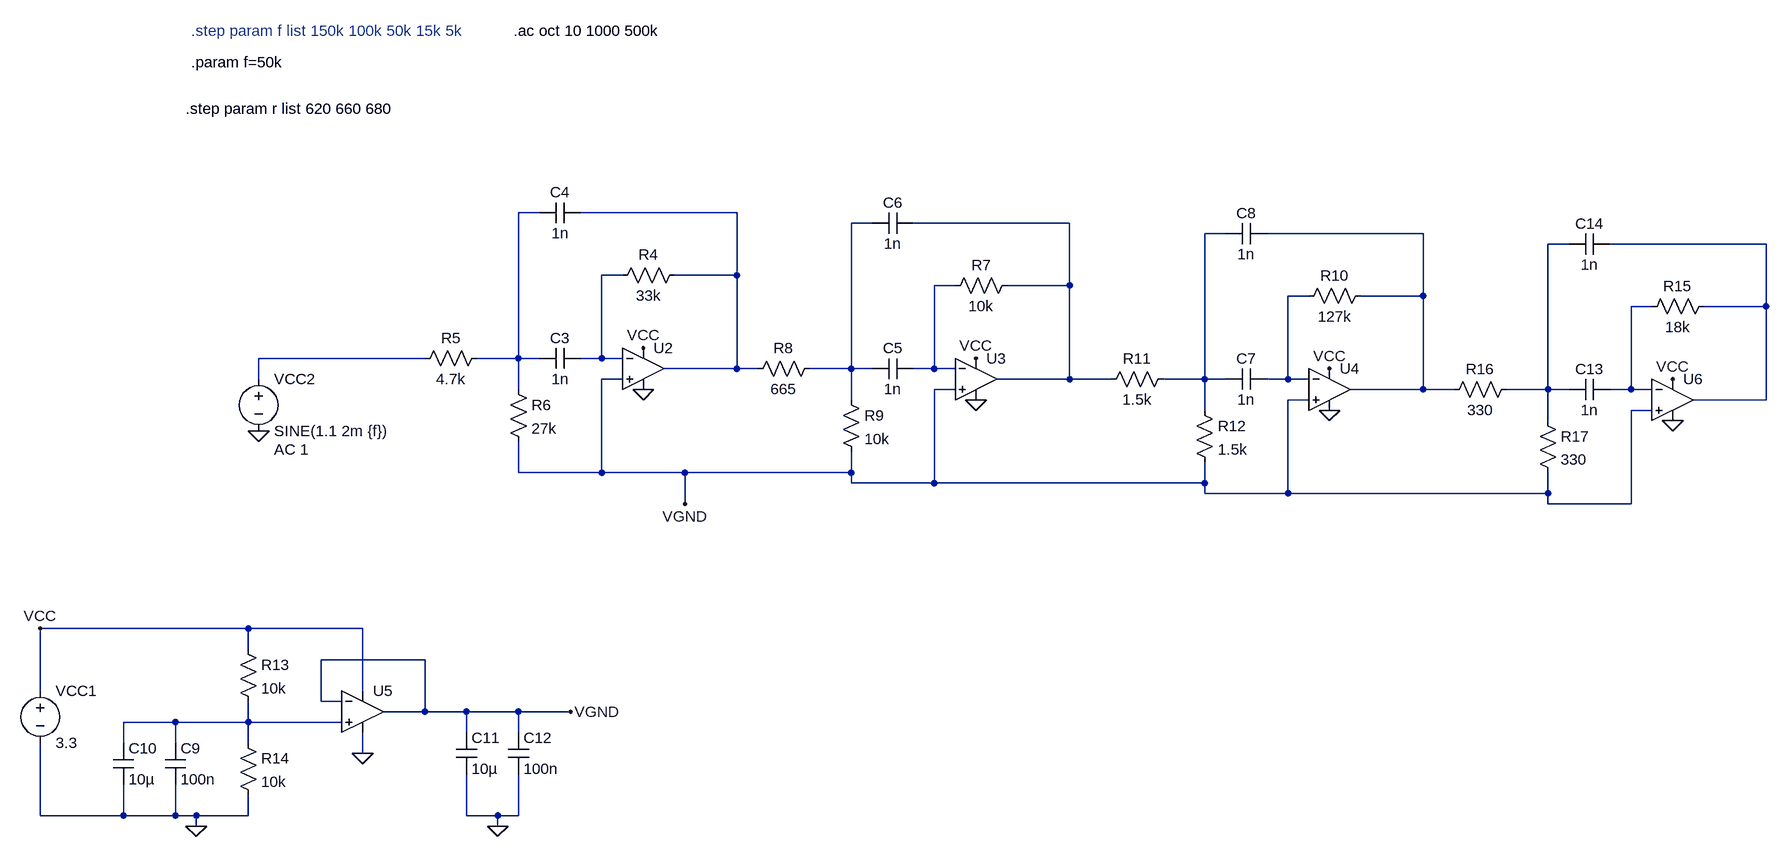
[diagram p0: schematic AudioFilter.asc]
AudioFilter.asc, the LTspice schematic file:
Version 4
SHEET 1 2344 852
WIRE 448 -112 416 -112
WIRE 752 -112 512 -112
WIRE 960 -96 928 -96
WIRE 1264 -96 1024 -96
WIRE 1504 -80 1472 -80
WIRE 1808 -80 1568 -80
WIRE 2032 -64 2000 -64
WIRE 2336 -64 2096 -64
WIRE 576 -16 544 -16
WIRE 752 -16 752 -112
WIRE 752 -16 656 -16
WIRE 1088 0 1056 0
WIRE 1264 0 1264 -96
WIRE 1264 0 1168 0
WIRE 1632 16 1600 16
WIRE 1808 16 1808 -80
WIRE 1808 16 1712 16
WIRE 2160 32 2128 32
WIRE 2336 32 2336 -64
WIRE 2336 32 2240 32
WIRE 272 112 16 112
WIRE 416 112 416 -112
WIRE 416 112 352 112
WIRE 448 112 416 112
WIRE 544 112 544 -16
WIRE 544 112 512 112
WIRE 576 112 544 112
WIRE 752 128 752 -16
WIRE 752 128 640 128
WIRE 784 128 752 128
WIRE 928 128 928 -96
WIRE 928 128 864 128
WIRE 960 128 928 128
WIRE 1056 128 1056 0
WIRE 1056 128 1024 128
WIRE 1088 128 1056 128
WIRE 16 144 16 112
WIRE 576 144 544 144
WIRE 1264 144 1264 0
WIRE 1264 144 1152 144
WIRE 1328 144 1264 144
WIRE 1472 144 1472 -80
WIRE 1472 144 1408 144
WIRE 1504 144 1472 144
WIRE 1600 144 1600 16
WIRE 1600 144 1568 144
WIRE 1632 144 1600 144
WIRE 416 160 416 112
WIRE 1088 160 1056 160
WIRE 1808 160 1808 16
WIRE 1808 160 1696 160
WIRE 1856 160 1808 160
WIRE 2000 160 2000 -64
WIRE 2000 160 1936 160
WIRE 2032 160 2000 160
WIRE 2128 160 2128 32
WIRE 2128 160 2096 160
WIRE 2160 160 2128 160
WIRE 928 176 928 128
WIRE 1632 176 1600 176
WIRE 2336 176 2336 32
WIRE 2336 176 2224 176
WIRE 1472 192 1472 144
WIRE 2160 192 2128 192
WIRE 2000 208 2000 160
WIRE 416 288 416 240
WIRE 544 288 544 144
WIRE 544 288 416 288
WIRE 672 288 544 288
WIRE 928 288 928 256
WIRE 928 288 672 288
WIRE 928 304 928 288
WIRE 1056 304 1056 160
WIRE 1056 304 928 304
WIRE 1472 304 1472 272
WIRE 1472 304 1056 304
WIRE 1472 320 1472 304
WIRE 1600 320 1600 176
WIRE 1600 320 1472 320
WIRE 2000 320 2000 288
WIRE 2000 320 1600 320
WIRE 672 336 672 288
WIRE 2000 336 2000 320
WIRE 2128 336 2128 192
WIRE 2128 336 2000 336
WIRE 0 528 -320 528
WIRE 176 528 0 528
WIRE 0 560 0 528
WIRE 272 576 112 576
WIRE -320 624 -320 528
WIRE 176 624 176 528
WIRE 112 640 112 576
WIRE 144 640 112 640
WIRE 272 656 272 576
WIRE 272 656 208 656
WIRE 336 656 272 656
WIRE 416 656 336 656
WIRE 496 656 416 656
WIRE -112 672 -192 672
WIRE 0 672 0 640
WIRE 0 672 -112 672
WIRE 144 672 0 672
WIRE 336 688 336 656
WIRE 416 688 416 656
WIRE -192 704 -192 672
WIRE -112 704 -112 672
WIRE 0 704 0 672
WIRE 176 720 176 688
WIRE -320 816 -320 704
WIRE -192 816 -192 768
WIRE -192 816 -320 816
WIRE -112 816 -112 768
WIRE -112 816 -192 816
WIRE -80 816 -112 816
WIRE 0 816 0 784
WIRE 0 816 -80 816
WIRE 336 816 336 752
WIRE 384 816 336 816
WIRE 416 816 416 752
WIRE 416 816 384 816
WIRE -80 832 -80 816
WIRE 384 832 384 816
FLAG 608 160 0
FLAG 608 96 VCC
FLAG 1120 176 0
FLAG 1120 112 VCC
FLAG 1664 192 0
FLAG 1664 128 VCC
FLAG -80 832 0
FLAG 496 656 VGND
FLAG 384 832 0
FLAG 176 720 0
FLAG -320 528 VCC
FLAG 672 336 VGND
FLAG 16 224 0
FLAG 2192 208 0
FLAG 2192 144 VCC
SYMBOL Opamps\\UniversalOpamp2 608 128 R0
SYMATTR InstName U2
SYMATTR Value2 Avol=1Meg GBW=15Meg Slew=10Meg
SYMBOL res 560 0 R270
WINDOW 0 32 56 VTop 2
WINDOW 3 0 56 VBottom 2
SYMATTR InstName R4
SYMATTR Value 33k
SYMBOL res 256 128 R270
WINDOW 0 32 56 VTop 2
WINDOW 3 0 56 VBottom 2
SYMATTR InstName R5
SYMATTR Value 4.7k
SYMBOL res 400 144 R0
SYMATTR InstName R6
SYMATTR Value 27k
SYMBOL cap 512 96 R90
WINDOW 0 0 32 VBottom 2
WINDOW 3 32 32 VTop 2
SYMATTR InstName C3
SYMATTR Value 1n
SYMBOL cap 512 -128 R90
WINDOW 0 0 32 VBottom 2
WINDOW 3 32 32 VTop 2
SYMATTR InstName C4
SYMATTR Value 1n
SYMBOL Opamps\\UniversalOpamp2 1120 144 R0
SYMATTR InstName U3
SYMATTR Value2 Avol=1Meg GBW=15Meg Slew=10Meg
SYMBOL res 1072 16 R270
WINDOW 0 32 56 VTop 2
WINDOW 3 0 56 VBottom 2
SYMATTR InstName R7
SYMATTR Value 10k
SYMBOL res 768 144 R270
WINDOW 0 32 56 VTop 2
WINDOW 3 0 56 VBottom 2
SYMATTR InstName R8
SYMATTR Value 665
SYMBOL res 912 160 R0
SYMATTR InstName R9
SYMATTR Value 10k
SYMBOL cap 1024 112 R90
WINDOW 0 0 32 VBottom 2
WINDOW 3 32 32 VTop 2
SYMATTR InstName C5
SYMATTR Value 1n
SYMBOL cap 1024 -112 R90
WINDOW 0 0 32 VBottom 2
WINDOW 3 32 32 VTop 2
SYMATTR InstName C6
SYMATTR Value 1n
SYMBOL Opamps\\UniversalOpamp2 1664 160 R0
SYMATTR InstName U4
SYMATTR Value2 Avol=1Meg GBW=15Meg Slew=10Meg
SYMBOL res 1616 32 R270
WINDOW 0 32 56 VTop 2
WINDOW 3 0 56 VBottom 2
SYMATTR InstName R10
SYMATTR Value 127k
SYMBOL res 1312 160 R270
WINDOW 0 32 56 VTop 2
WINDOW 3 0 56 VBottom 2
SYMATTR InstName R11
SYMATTR Value 1.5k
SYMBOL res 1456 176 R0
SYMATTR InstName R12
SYMATTR Value 1.5k
SYMBOL cap 1568 128 R90
WINDOW 0 0 32 VBottom 2
WINDOW 3 32 32 VTop 2
SYMATTR InstName C7
SYMATTR Value 1n
SYMBOL cap 1568 -96 R90
WINDOW 0 0 32 VBottom 2
WINDOW 3 32 32 VTop 2
SYMATTR InstName C8
SYMATTR Value 1n
SYMBOL Opamps\\UniversalOpamp2 176 656 R0
SYMATTR InstName U5
SYMBOL voltage -320 608 R0
WINDOW 123 0 0 Left 2
WINDOW 39 0 0 Left 2
SYMATTR InstName VCC1
SYMATTR Value 3.3
SYMBOL res -16 544 R0
SYMATTR InstName R13
SYMATTR Value 10k
SYMBOL res -16 688 R0
SYMATTR InstName R14
SYMATTR Value 10k
SYMBOL cap -128 704 R0
SYMATTR InstName C9
SYMATTR Value 100n
SYMBOL cap -208 704 R0
SYMATTR InstName C10
SYMATTR Value 10µ
SYMBOL cap 320 688 R0
SYMATTR InstName C11
SYMATTR Value 10µ
SYMBOL cap 400 688 R0
SYMATTR InstName C12
SYMATTR Value 100n
SYMBOL voltage 16 128 R0
WINDOW 123 24 124 Left 2
WINDOW 39 0 0 Left 2
SYMATTR Value2 AC 1
SYMATTR InstName VCC2
SYMATTR Value SINE(1.1 2m {f})
SYMBOL Opamps\\UniversalOpamp2 2192 176 R0
SYMATTR InstName U6
SYMATTR Value2 Avol=1Meg GBW=15Meg Slew=10Meg
SYMBOL res 2144 48 R270
WINDOW 0 32 56 VTop 2
WINDOW 3 0 56 VBottom 2
SYMATTR InstName R15
SYMATTR Value 18k
SYMBOL res 1840 176 R270
WINDOW 0 32 56 VTop 2
WINDOW 3 0 56 VBottom 2
SYMATTR InstName R16
SYMATTR Value 330
SYMBOL res 1984 192 R0
SYMATTR InstName R17
SYMATTR Value 330
SYMBOL cap 2096 144 R90
WINDOW 0 0 32 VBottom 2
WINDOW 3 32 32 VTop 2
SYMATTR InstName C13
SYMATTR Value 1n
SYMBOL cap 2096 -80 R90
WINDOW 0 0 32 VBottom 2
WINDOW 3 32 32 VTop 2
SYMATTR InstName C14
SYMATTR Value 1n
TEXT -88 -392 Left 2 ;.step param f list 150k 100k 50k 15k 5k
TEXT 408 -392 Left 2 !.ac oct 10 1000 500k
TEXT -88 -344 Left 2 !.param f=50k
TEXT -96 -272 Left 2 !.step param r list 620 660 680

The netlist it stands for:
* AudioFilter.asc
XU2 VGND N009 VCC 0 N002 level.2 Avol=1Meg GBW=15Meg Slew=10Meg ilimit=25m rail=0 Vos=0 phimargin=45 en=0 enk=0 in=0 ink=0 Rin=500Meg  ; pins IN+ IN- V+ V- OUT
R4 N009 N002 33k
R5 N013 N001 4.7k
R6 N001 VGND 27k
C3 N009 N001 1n
C4 N002 N001 1n
XU3 VGND N010 VCC 0 N004 level.2 Avol=1Meg GBW=15Meg Slew=10Meg ilimit=25m rail=0 Vos=0 phimargin=45 en=0 enk=0 in=0 ink=0 Rin=500Meg  ; pins IN+ IN- V+ V- OUT
R7 N010 N004 10k
R8 N002 N003 665
R9 N003 VGND 10k
C5 N010 N003 1n
C6 N004 N003 1n
XU4 VGND N011 VCC 0 N006 level.2 Avol=1Meg GBW=15Meg Slew=10Meg ilimit=25m rail=0 Vos=0 phimargin=45 en=0 enk=0 in=0 ink=0 Rin=500Meg  ; pins IN+ IN- V+ V- OUT
R10 N011 N006 127k
R11 N004 N005 1.5k
R12 N005 VGND 1.5k
C7 N011 N005 1n
C8 N006 N005 1n
XU5 N014 VGND VCC 0 VGND level.2 Avol=1Meg GBW=10Meg Slew=10Meg ilimit=25m rail=0 Vos=0 phimargin=45 en=0 enk=0 in=0 ink=0 Rin=500Meg  ; pins IN+ IN- V+ V- OUT
VCC1 VCC 0 3.3
R13 VCC N014 10k
R14 N014 0 10k
C9 N014 0 100n
C10 N014 0 10µ
C11 VGND 0 10µ
C12 VGND 0 100n
VCC2 N013 0 SINE(1.1 2m {f}) AC 1
XU6 VGND N012 VCC 0 N008 level.2 Avol=1Meg GBW=15Meg Slew=10Meg ilimit=25m rail=0 Vos=0 phimargin=45 en=0 enk=0 in=0 ink=0 Rin=500Meg  ; pins IN+ IN- V+ V- OUT
R15 N012 N008 18k
R16 N006 N007 330
R17 N007 VGND 330
C13 N012 N007 1n
C14 N008 N007 1n
* .step param f list 150k 100k 50k 15k 5k
.ac oct 10 1000 500k
.param f=50k
.step param r list 620 660 680
.lib UniversalOpamps2.sub
.backanno
.end